# Altium schematic sheet LED.SchDoc
size A4
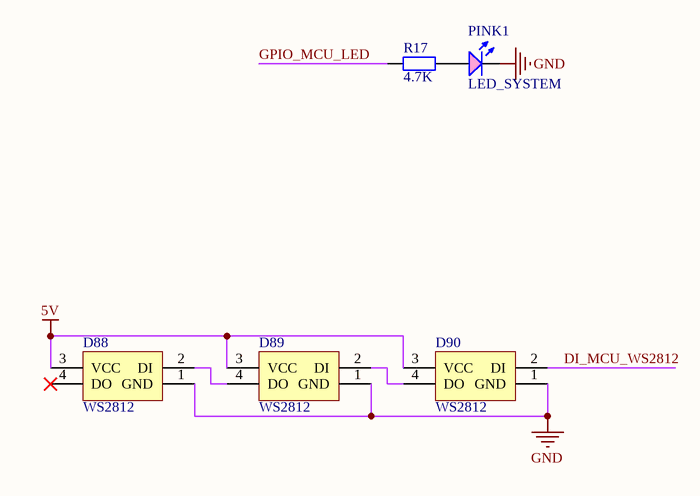
[diagram p0: LED.SchDoc]

## Parts
D88  WS2812  [RGB_LED_1206]
D89  WS2812  [RGB_LED_1206]
D90  WS2812  [RGB_LED_1206]
PINK1  LED_SYSTEM  [LED_0603_R]
R17  4.7K  [Res-0603]

## Nets
5V: D88.3(VCC) D89.3(VCC) D90.3(VCC)
GND: D88.1(GND) D89.1(GND) D90.1(GND) PINK1.2(K)
DI_MCU_WS2812: D90.2(DI)
GPIO_MCU_LED: R17.2
NetD88_2: D88.2(DI) D89.4(DO)
NetD89_2: D89.2(DI) D90.4(DO)
NetPINK1_1: PINK1.1(A) R17.1

Not connected (* = marked no-connect by the designer): D88 4(DO)*

## Notes on the sheet
- Title
- Size:
- Date:
- A4
- Number:
- Time:
- Revision:
- Sheet
- of
- File:

## Library data of the parts
PINK1 = LED_SMD_PINK: 发光二极管; ComponentLink1Description: 供应商链接; ComponentLink1URL: http://www.szlcsc.com/product/details_2659.html; Package: 0603; Supplier: LC; SuppliersPartNumber: C2286
R17 = RES: 贴片电阻
D88-D90 = WS2812: Publisher: mazhongwei; Published: 8-August-2017; PackageReference: RGB_LED_5050